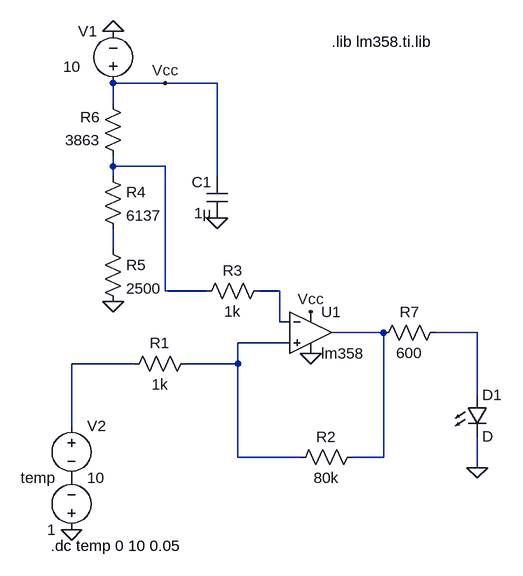
[diagram p0: schematic Voltage_drop_sim.asc]
Voltage_drop_sim.asc, the LTspice schematic file:
Version 4
SHEET 1 880 680
WIRE 64 -128 -16 -128
WIRE 144 -128 64 -128
WIRE -16 -96 -16 -128
WIRE -16 0 -16 -16
WIRE 64 0 -16 0
WIRE -16 16 -16 0
WIRE 144 16 144 -128
WIRE -16 128 -16 96
WIRE 64 192 64 0
WIRE 128 192 64 192
WIRE 240 192 208 192
WIRE 240 240 240 192
WIRE 256 240 240 240
WIRE 400 256 320 256
WIRE 544 256 480 256
WIRE 256 272 176 272
WIRE 16 304 -80 304
WIRE 176 304 176 272
WIRE 176 304 96 304
WIRE 544 352 544 256
WIRE -80 400 -80 304
WIRE 176 448 176 304
WIRE 272 448 176 448
WIRE 400 448 400 256
WIRE 400 448 352 448
WIRE 544 464 544 416
FLAG -16 208 0
FLAG 144 80 0
FLAG 64 -128 Vcc
FLAG -16 -208 0
FLAG 288 224 Vcc
FLAG 288 288 0
FLAG 544 464 0
FLAG -80 560 0
SYMBOL res 112 288 R90
WINDOW 0 0 56 VBottom 2
WINDOW 3 32 56 VTop 2
SYMATTR InstName R1
SYMATTR Value 1k
SYMBOL res 368 432 R90
WINDOW 0 0 56 VBottom 2
WINDOW 3 32 56 VTop 2
SYMATTR InstName R2
SYMATTR Value 80k
SYMBOL res 112 208 R270
WINDOW 0 32 56 VTop 2
WINDOW 3 0 56 VBottom 2
SYMATTR InstName R3
SYMATTR Value 1k
SYMBOL res -32 0 R0
SYMATTR InstName R4
SYMATTR Value 6137
SYMBOL res -32 112 R0
SYMATTR InstName R5
SYMATTR Value 2500
SYMBOL cap 160 80 R180
WINDOW 0 24 56 Left 2
WINDOW 3 24 8 Left 2
SYMATTR InstName C1
SYMATTR Value 1µ
SYMBOL res 0 0 R180
WINDOW 0 36 76 Left 2
WINDOW 3 36 40 Left 2
SYMATTR InstName R6
SYMATTR Value 3863
SYMBOL voltage -16 -112 R180
WINDOW 0 24 96 Left 2
WINDOW 3 50 41 Left 2
WINDOW 123 0 0 Left 0
WINDOW 39 0 0 Left 0
SYMATTR InstName V1
SYMATTR Value 10
SYMBOL res 496 240 R90
WINDOW 0 0 56 VBottom 2
WINDOW 3 32 56 VTop 2
SYMATTR InstName R7
SYMATTR Value 600
SYMBOL OpAmps\\opamp2 288 192 R0
SYMATTR InstName U1
SYMATTR Value lm358
SYMBOL LED 528 352 R0
SYMATTR InstName D1
SYMBOL voltage -80 576 R180
WINDOW 0 24 96 Left 2
WINDOW 3 24 16 Left 2
WINDOW 123 0 0 Left 0
WINDOW 39 0 0 Left 0
SYMATTR InstName temp
SYMATTR Value 1
SYMBOL voltage -80 384 R0
WINDOW 123 0 0 Left 0
WINDOW 39 0 0 Left 0
SYMATTR InstName V2
SYMATTR Value 10
TEXT 320 -192 Left 2 !.lib lm358.ti.lib
TEXT -112 584 Left 2 !.dc temp 0 10 0.05

The netlist it stands for:
* Voltage_drop_sim.asc
R1 N006 N007 1k
R2 N004 N006 80k
R3 N001 N003 1k
R4 N001 N002 6137
R5 N002 0 2500
C1 0 Vcc 1µ
R6 N001 Vcc 3863
V1 Vcc 0 10
R7 N005 N004 600
XU1 N006 N003 Vcc 0 N004 lm358  ; pins In+ In- V+ V- OUT
D1 N005 0 D
V§temp 0 P001 1
V2 N007 P001 10
.model D D
.lib standard.dio
.lib lm358.ti.lib
.dc temp 0 10 0.05
.backanno
.end